# Altium schematic sheet SuperSmartSwitch.SchDoc
size A4; SheetNumber: 1; SheetTotal: 1
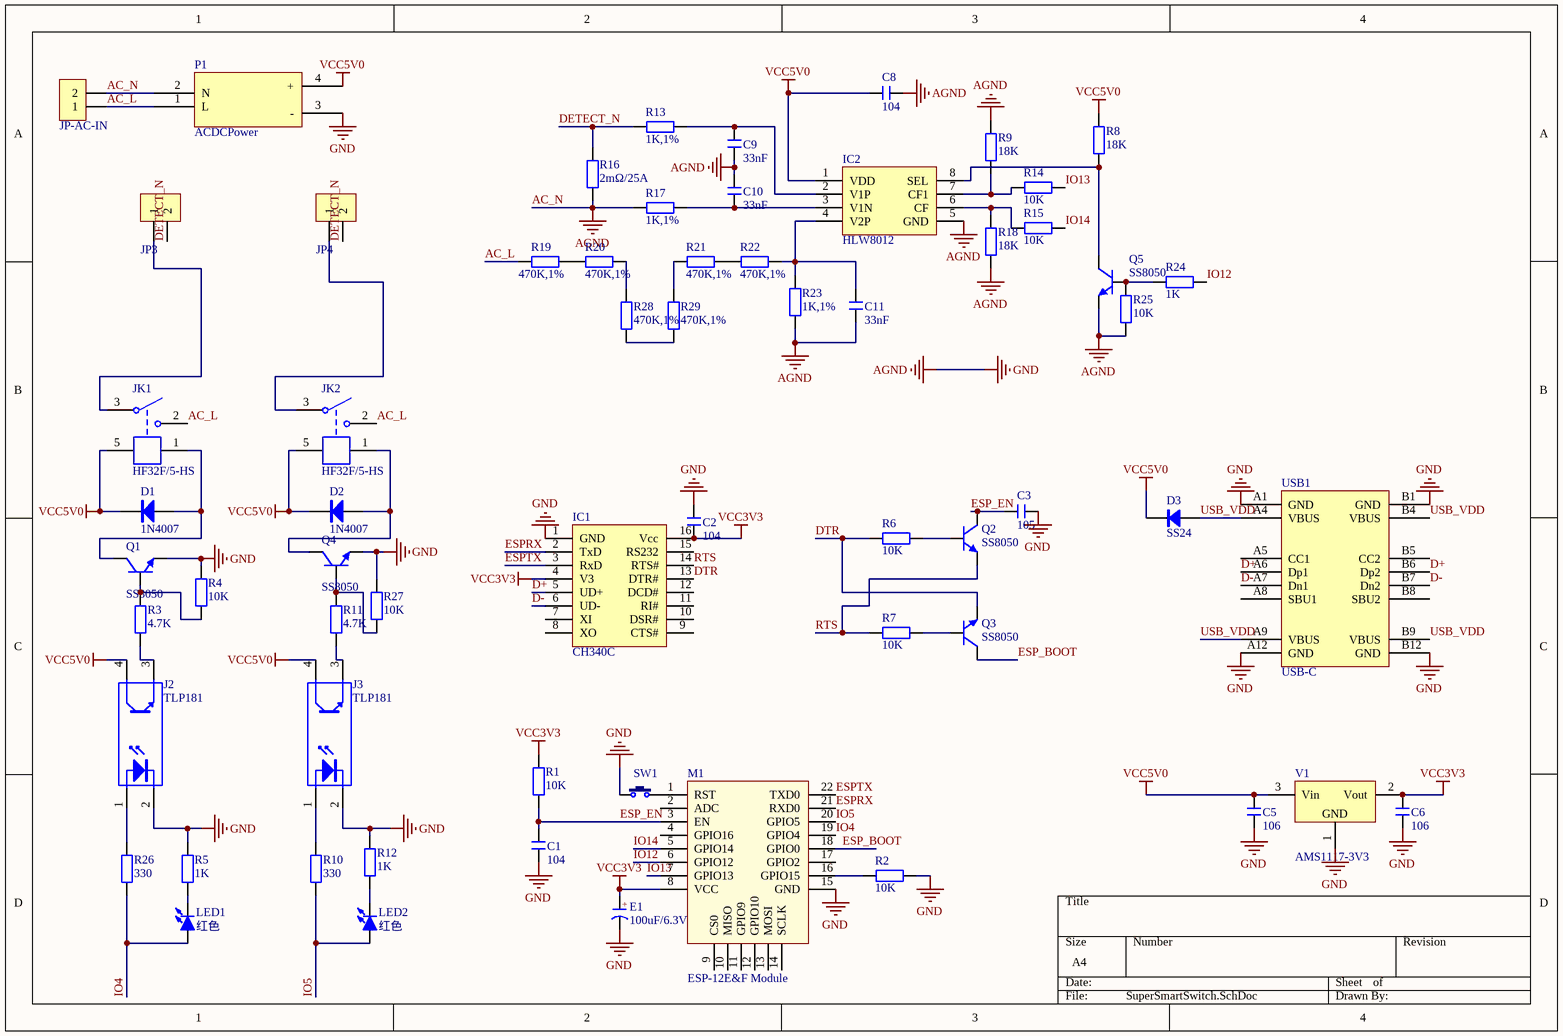
[diagram p0: SuperSmartSwitch.SchDoc]

## Parts
C1  104  [C 0603_L]
C2  104  [C 0603_L]
C3  105  [C 0603_L]
C5  106  [C 0603_L]
C6  106  [C 0603_L]
C8  104  [C 0603_L]
C9  33nF  [C 0805_L]
C10  33nF  [C 0805_L]
C11  33nF  [C 0805_L]
D1  1N4007  [SOD-123]
D2  1N4007  [SOD-123]
D3  SS24  [SMB]
E1  100uF/6.3V  [CD A(3216)]
IC1  CH340C  [SOP16_N]
IC2  HLW8012  [SOP8_M]
J2  TLP181  [SOP4_N]
J3  TLP181  [SOP4_N]
JK1  HF32F/5-HS  [JZC-32F_1H]
JK2  HF32F/5-HS  [JZC-32F_1H]
JP3  HDR-1X2  [KF128-5.08-2P]  (value not drawn)
JP4  HDR-1X2  [KF128-5.08-2P]  (value not drawn)
JP-AC-IN  HDR-1X2  [KF128-5.08-2P]  (value not drawn)
LED1  红色  [LED 0603B]
LED2  红色  [LED 0603B]
M1  ESP-12E&F Module  [ESP-12E&F Module]
P1  ACDCPower  [ADDC]
Q1  SS8050  [SOT23-3N]
Q2  SS8050  [SOT23-3N]
Q3  SS8050  [SOT23-3N]
Q4  SS8050  [SOT23-3N]
Q5  SS8050  [SOT23-3N]
R1  10K  [R 0603_L]
R2  10K  [R 0603_L]
R3  4.7K  [R 0603_L]
R4  10K  [R 0603_L]
R5  1K  [R 0603_L]
R6  10K  [R 0603_L]
R7  10K  [R 0603_L]
R8  18K  [R 0603_L]
R9  18K  [R 0603_L]
R10  330  [R 0603_L]
R11  4.7K  [R 0603_L]
R12  1K  [R 0603_L]
R13  1K,1%  [R 0805_L]
R14  10K  [R 0603_L]
R15  10K  [R 0603_L]
R16  2mΩ/25A  [R 2512_L]
R17  1K,1%  [R 0805_L]
R18  18K  [R 0603_L]
R19  470K,1%  [R 0805_L]
R20  470K,1%  [R 0805_L]
R21  470K,1%  [R 0805_L]
R22  470K,1%  [R 0805_L]
R23  1K,1%  [R 0805_L]
R24  1K  [R 0603_L]
R25  10K  [R 0603_L]
R26  330  [R 0603_L]
R27  10K  [R 0603_L]
R28  470K,1%  [R 0805_L]
R29  470K,1%  [R 0805_L]
SW1  3x4x5  [TS3x4x2]  (value not drawn)
USB1  USB-C  [USB Type-C-16Pin_A]
V1  AMS1117-3V3  [SOT223_N]

## Nets
AC_N: C1.1 C2.1 C3.1 C5.1 C6.1 C8.2 C9.1 C10.2 C11.1 E1.2(K) IC1.1(GND) IC2.5(GND) J2.2(K) J3.2(K) JP-AC-IN.2 M1.15(GND) P1.2(N) P1.3(-) Q1.2(E) Q4.2(E) Q5.2(E) R2.1 R4.2 R5.1 R9.1 R12.1 R16.2 R17.2 R18.2 R23.1 R25.2 R27.2 SW1.1 USB1.A1(GND) USB1.A12(GND) USB1.B1(GND) USB1.B12(GND) V1.1(GND)  [also labelled AGND, GND]
VCC3V3: C2.2 C6.2 E1.1(A) IC1.4(V3) IC1.16(Vcc) M1.8(VCC) R1.2 V1.2(Vout)
VCC5V0: C5.2 C8.1 D1.2(K) D2.2(K) D3.2(K) IC2.1(VDD) J2.4(C) J3.4(C) JK1.5 JK2.5 P1.4(+) R8.1 V1.3(Vin)
AC_L: JK1.2 JK2.2 JP-AC-IN.1 P1.1(L) R19.2
D+: IC1.5(UD+) USB1.A6(Dp1) USB1.B6(Dp2)
D-: IC1.6(UD-) USB1.A7(Dn1) USB1.B7(Dn2)
DETECT_N: JP3.2 JP4.2 R13.2 R16.1
DTR: IC1.13(DTR#) Q3.2(E) R6.1
ESP_BOOT: M1.18(GPIO0) Q3.3(C)
ESP_EN: C1.2 C3.2 M1.3(EN) Q2.3(C) R1.1
ESPRX: IC1.2(TxD) M1.21(RXD0)
ESPTX: IC1.3(RxD) M1.22(TXD0)
IO4: LED1.1(A) M1.19(GPIO4) R26.1
IO5: LED2.1(A) M1.20(GPIO5) R10.1
IO12: M1.6(GPIO12) R24.1
IO13: M1.7(GPIO13) R14.1
IO14: M1.5(GPIO14) R15.1
RTS: IC1.14(RTS#) Q2.2(E) R7.1
USB_VDD: D3.1(A) USB1.A4(VBUS) USB1.A9(VBUS) USB1.B4(VBUS) USB1.B9(VBUS)
NetC9_2: C9.2 IC2.2(V1P) R13.1
NetC10_1: C10.1 IC2.3(V1N) R17.1
NetC11_2: C11.2 IC2.4(V2P) R22.1 R23.2
NetD1_1: D1.1(A) JK1.1 Q1.3(C)
NetD2_1: D2.1(A) JK2.1 Q4.3(C)
NetIC2_6: IC2.6(CF) R15.2 R18.1
NetIC2_7: IC2.7(CF1) R9.2 R14.2
NetIC2_8: IC2.8(SEL) Q5.3(C) R8.2
NetJ2_1: J2.1(A) R26.2
NetJ2_3: J2.3(E) R3.2
NetJ3_1: J3.1(A) R10.2
NetJ3_3: J3.3(E) R11.2
NetJK1_3: JK1.3 JP3.1
NetJK2_3: JK2.3 JP4.1
NetLED1_2: LED1.2(K) R5.2
NetLED2_2: LED2.2(K) R12.2
NetM1_1: M1.1(RST) SW1.2
NetM1_16: M1.16(GPIO15) R2.2
NetQ1_1: Q1.1(B) R3.1 R4.1
NetQ2_1: Q2.1(B) R6.2
NetQ3_1: Q3.1(B) R7.2
NetQ4_1: Q4.1(B) R11.1 R27.1
NetQ5_1: Q5.1(B) R24.2 R25.1
NetR19_1: R19.1 R20.2
NetR20_1: R20.1 R28.1
NetR21_1: R21.1 R22.2
NetR21_2: R21.2 R29.1
NetR28_2: R28.2 R29.2

Not connected (* = marked no-connect by the designer): IC1 7(XI) 8(XO) 9(CTS#) 10(DSR#) 11(RI#) 12(DCD#) 15(RS232); M1 2(ADC) 4(GPIO16) 9(CS0) 10(MISO) 11(GPIO9) 12(GPIO10) 13(MOSI) 14(SCLK) 17(GPIO2); USB1 A5(CC1) A8(SBU1) B5(CC2) B8(SBU2)

## Notes on the sheet
- (in symbol C-CD) +

## Library data of the parts
C1-C3 C5 C6 C8-C11 = C: 无极性贴片电容; 版权归属: 源创客; 材质: X7R; BOM名称: 无极性贴片电容; 学习资源: www.ooocke.com
D1 D2 = 1N4007: 整流二极管; 版权归属: 源创客; BOM名称: 整流二极管; 学习资源: www.ooocke.com
D3 = SS24: 肖特基二极管; 版权归属: 源创客; 属性: 40V/2A; BOM名称: 肖特基二极管; 学习资源: www.ooocke.com
E1 = C-CD: 贴片钽电容; 版权归属: 源创客; BOM名称: 贴片钽电容; 学习资源: www.ooocke.com
IC1 = CH340G: 串口转USB; 版权归属: 源创客; BOM名称: 串口转USB; 学习资源: www.ooocke.com
IC2 = HLW8012: BOM名称: 气压传感器; 版权归属: 源创客; 学习资源: www.ooocke.com
J2 J3 = TLP181_1: 光耦; 版权归属: 源创客; BOM名称: 光耦; 学习资源: www.ooocke.com
JK1 JK2 = HF32F/5-HS: 5V一组常开; BOM名称: 5V继电器; 版权归属: 源创客; 学习资源: www.ooocke.com
JP3 JP4 JP-AC-IN = Header 2: 2P接插件; 版权归属: 源创客; BOM名称: 2P接插件; 学习资源: www.ooocke.com
LED1 LED2 = LED-SMD: 贴片LED; 版权归属: 源创客; BOM名称: 贴片LED; 学习资源: www.ooocke.com
Q1-Q5 = 8050-SMD: 高频放大-NPN型; 版权归属: 源创客; 属性: 40V 1.5A 1W 100MHZ; BOM名称: 高频放大-NPN型; 学习资源: www.ooocke.com
R1-R29 = R: 贴片电阻; 版权归属: 源创客; BOM名称: 贴片电阻; 学习资源: www.ooocke.com
SW1 = TS 3x4: 3x4轻触开关; BOM名称: 3x6轻触开关; 版权归属: 源创客; 学习资源: www.ooocke.com
USB1 = USB-C-16P: USB-C型母接口; 版权归属: 源创客; BOM名称: USB-C型母接口; 学习资源: www.ooocke.com
V1 = AMS1117: 三端稳压芯片; BOM名称: 稳压芯片; 版权归属: 源创客; 学习资源: www.ooocke.com